# EAGLE design PRC-1605-AFC (EAGLE 9.5.0)
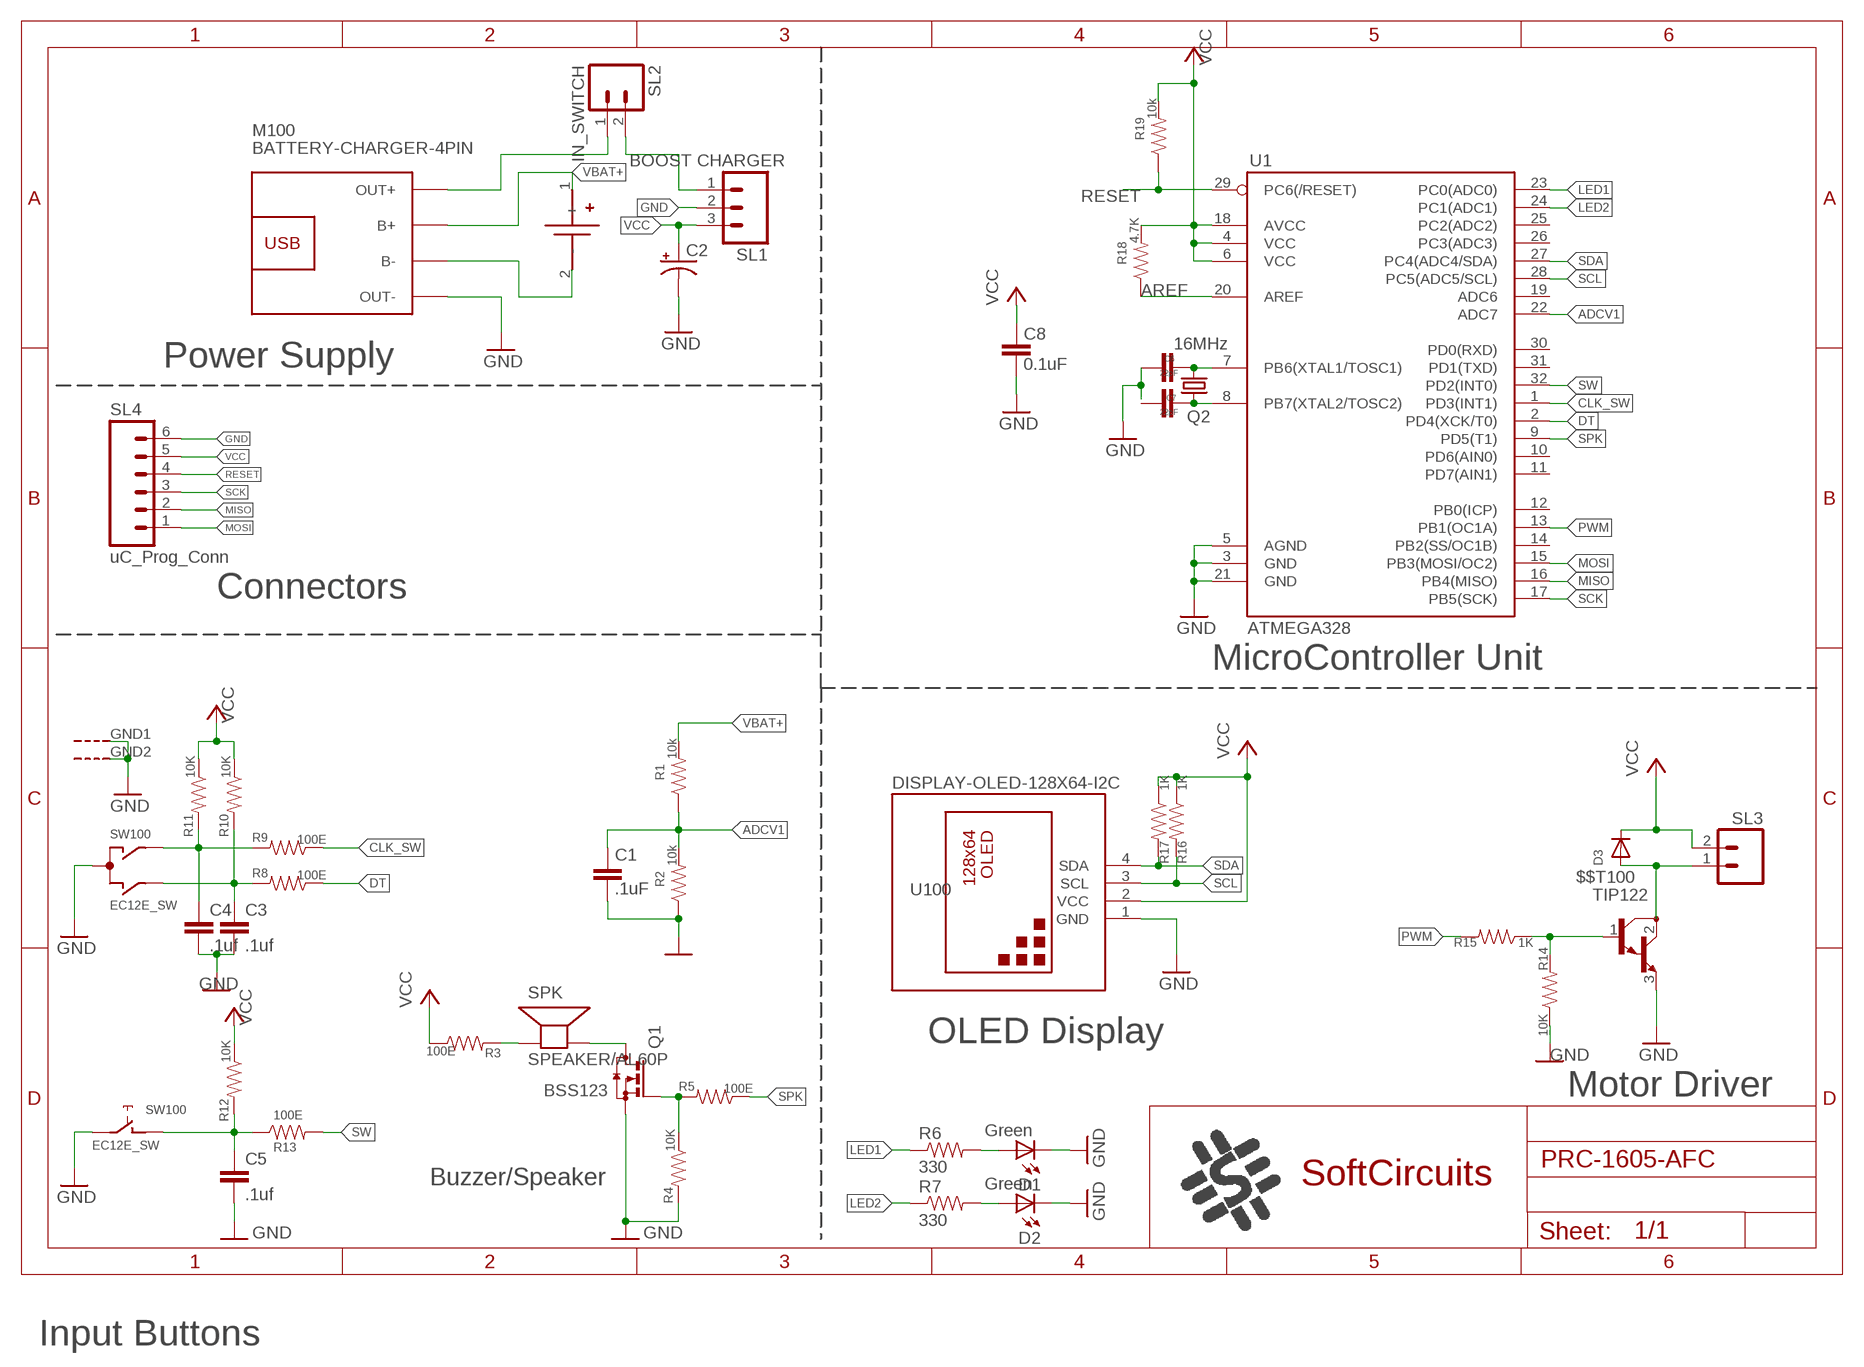
[diagram p0: schematic, sheet 1]

## Parts
$$T100  TIP122  [TO220]
C1  .1uF  C-EUC1206  [C1206]
C2  CPOL-USE2.5-7  [E2,5-7]
C3  .1uf  C-EUC1206  [C1206]
C4  .1uf  C-EUC1206  [C1206]
C5  .1uf  C-EUC1206  [C1206]
C6  22pF  C-EUC1206  [C1206]
C7  22pF  C-EUC1206  [C1206]
C8  0.1uF  C-EUC1206  [C1206]
D1  Green  LEDCHIPLED_1206  [CHIPLED_1206]
D2  Green  LEDCHIPLED_1206  [CHIPLED_1206]
D3  DIODESMA  [SMADIODE]
LOGO100  SC_LOGO  [SC_LOGO]
M100  BATTERY-CHARGER-4PIN  [BATTERY-CHARGER-LI-4PIN]
Q1  BSS123  [SOT23]
Q2  16MHz  CRYSTALHC49UP  [HC49UP]
R1  10k  RESISTOR1206  [1206]
R2  10k  RESISTOR1206  [1206]
R3  100E  RESISTOR1206  [1206]
R4  10K  RESISTOR1206  [1206]
R5  100E  RESISTOR1206  [1206]
R6  330  RESISTOR1206  [1206]
R7  330  RESISTOR1206  [1206]
R8  100E  RESISTOR1206  [1206]
R9  100E  RESISTOR1206  [1206]
R10  10K  RESISTOR1206  [1206]
R11  10K  RESISTOR1206  [1206]
R12  10K  RESISTOR1206  [1206]
R13  100E  RESISTOR1206  [1206]
R14  10K  RESISTOR1206  [1206]
R15  1K  RESISTOR1206  [1206]
R16  1K  RESISTOR1206  [1206]
R17  1K  RESISTOR1206  [1206]
R18  4.7K  RESISTOR1206  [1206]
R19  10k  RESISTOR1206  [1206]
SL1  BOOST CHARGER  M03  [03P]
SL2  IN_SWITCH  M02  [02P]
SL3  M02  [02P]
SL4  uC_Prog_Conn  M06  [06P]
SPK  SPEAKER/AL60P  [AL60P]
SW100  EC12E_SW  [ALPS_EC12E_SW]
U1  ATMEGA328  ATMEGA168  [TQFP32-08]
U100  DISPLAY-OLED-128X64-I2C  [DISPLAY-OLED-128X64-I2C]
U$2  BLOSSOM-BLM-18650-1PCS  [BLOSSOM-BLM-18650-1PCS]

## Nets
ADCV1: C1.1 R1.1 R2.2 U1.22(ADC7)
AREF: R18.1 U1.20(AREF)
CLK_SW: R9.1 U1.1(PD3(INT1))
DT: R8.1 U1.2(PD4(XCK/T0))
GND: $$T100.3(E) C1.2 C2.- C3.2 C4.2 C5.2 C6.2 C7.2 C8.1 D1.C D2.C M100.OUT- Q1.2(S) R2.1 R4.2 R14.1 SL1.2 SL4.6 SW100.C SW100.E SW100.GND1(G) SW100.GND2(G) U1.3(GND) U1.5(AGND) U1.21(GND) U100.1(GND)
LED1: R6.1 U1.23(PC0(ADC0))
LED2: R7.1 U1.24(PC1(ADC1))
MISO: SL4.2 U1.16(PB4(MISO))
MOSI: SL4.1 U1.15(PB3(MOSI/OC2))
N$1: R3.2 SPK.1(+)
N$2: C5.1 R12.2 R13.1 SW100.D
N$3: Q1.3(D) SPK.2(-)
N$5: SL1.1 SL2.2
N$7: C4.1 R9.2 R11.2 SW100.A
N$8: M100.B- U$2.2(-)
N$9: Q1.1(G) R4.1 R5.2
N$10: D2.A R7.2
N$11: C3.1 R8.2 R10.2 SW100.B
N$15: C7.1 Q2.1 U1.8(PB7(XTAL2/TOSC2))
N$16: C6.1 Q2.2 U1.7(PB6(XTAL1/TOSC1))
N$17: D1.A R6.2
N$41: $$T100.1(B) R14.2 R15.1
N$46: $$T100.2(C) D3.A SL3.1
PWM: R15.2 U1.13(PB1(OC1A))
RESET: R19.1 SL4.4 U1.29(PC6(/RESET))
SCK: SL4.3 U1.17(PB5(SCK))
SCL: R16.2 U1.28(PC5(ADC5/SCL)) U100.3(SCL)
SDA: R17.2 U1.27(PC4(ADC4/SDA)) U100.4(SDA)
SPK: R5.1 U1.9(PD5(T1))
SW: R13.2 U1.32(PD2(INT0))
VBAT+: M100.B+ R1.2 U$2.1(+)
VCC: C2.+ C8.2 D3.C R3.1 R10.1 R11.1 R12.1 R16.1 R17.1 R18.2 R19.2 SL1.3 SL3.2 SL4.5 U1.4(VCC) U1.6(VCC) U1.18(AVCC) U100.2(VCC)
VOUT_CHG: M100.OUT+ SL2.1
Unconnected: U1.10(PD6(AIN0)) U1.11(PD7(AIN1)) U1.12(PB0(ICP)) U1.14(PB2(SS/OC1B)) U1.19(ADC6) U1.25(PC2(ADC2)) U1.26(PC3(ADC3)) U1.30(PD0(RXD)) U1.31(PD1(TXD))

## Notes on the sheet
- Power Supply
- Connectors
- MicroController Unit
- OLED Display
- Motor Driver
- Buzzer/Speaker | SoftCircuits
- Input Buttons

## Library data of the parts
$$T100 = transistor:TIP122: NPN BIPOLAR DARLINGTON TRANSISTOR
C1 C3-C8 = SoftCircuits-Capacitors:C-EU: CAPACITOR, European symbol; SPICEPREFIX: C
C2 = SoftCircuits-Capacitors:CPOL-US: POLARIZED CAPACITOR, American symbol; SPICEPREFIX: C
D1 D2 = adafruit:LED: LED OSRAM: - CHIPLED LG R971, LG N971, LY N971, LG Q971, LY Q971, LO R971, LY R971 LH N974, LH R974 LS Q976, LO Q976, LY Q976 LO Q996 - Hyper CHIPLED LW Q18S LB Q993, LB Q99A, LB R99A - SideLED LS A670, LO A670, LY A670, LG A670, LP A670 LB A673, LV A673, LT A673, LW A673 LH A674 LY A675 LS A676, LA A676, LO A676, LY A676, LW A676 LS A679, LY A679, LG A679 - Hyper Micro SIDELED® LS Y876, LA Y876, LO Y876, LY Y876 LT Y87S - SmartLED LW L88C, LW L88S LB L89C, LB L89S, LG L890 LS L89K, LO L89K, LY L89K LS L896, LA L896, LO L896, LY L896 - TOPLED LS T670, LO T670, LY T670, LG T670, LP T670 LSG T670, LSP T670, LSY T670, LOP T670, LYG T670 LG T671, LOG T671, LSG T671 LB T673, LV T673, LT T673, LW T673 LH T674 LS T676, LA T676, LO T676, LY T676, LB T676, LH T676, LSB T676, LW T676 LB T67C, LV T67C, LT T67C, LS T67K, LO T67K, LY T67K, LW E67C LS E67B, LA E67B, LO E67B, LY E67B, LB E67C, LV E67C, LT E67C LW T67C LS T679, LY T679, LG T679 LS T770, LO T770, LY T770, LG T770, LP T770 LB T773, LV T773, LT T773, LW T773 LH T774 LS E675, LA E675, LY E675, LS T675 LS T776, LA T776, LO T776, LY T776, LB T776 LHGB T686 LT T68C, LB T68C - Hyper Mini TOPLED® LB M676 - Mini TOPLED Santana® LG M470 LS M47K, LO M47K, LY M47K Source: http://www.osram.convergy.de/
D3 = adafruit:DIODE: Diode SMADIODE - SMA Surface Mount Package 20V 1A Schottky Diode Digikey: 641-1014-6-ND DO-1N4148 - Through Hole Small Current Diode SOD-123 20V 1 A (.5mV Vf) Schottky Diode - Digikey: MBRX120TPMSCT-ND SOD-323 10V 570mA (.38mV Vf, 3ns) Schottky Diode - Digikey: ZLLS410CT-ND SOD-523 30V 30mA Schottky Diode (RB751S-40TE61) - Digikey: RB751S-40TE61CT-ND SOT23-R/W - SOT23 Package (R = Solder Paste/Reflow Ovens, W = Hand-Soldering) BAT54Film 40V 300mA - Digikey: 497-7162-1-ND
LOGO100 = _SoftCircuits_logo:SC_LOGO; SIZE: 150DPI
M100 = Battery_Charger_Li:BATTERY-CHARGER-4PIN: Li-ion battery charger module with micro USB input. [library edited to remove 2 input pins]
Q1 = transistor-small-signal:BSS123: N-CHANNEL MOS FET
Q2 = adafruit:CRYSTAL: CRYSTAL; OC_FARNELL: unknown; OC_NEWARK: unknown
R1-R19 = SoftCircuits-Resistors:RESISTOR: Resistor Basic schematic elements and footprints for 0603, 1206, and PTH resistors.
SL1 = con-amp-quick:M03: AMP QUICK CONNECTOR; OC_FARNELL: unknown; OC_NEWARK: unknown
SL2 SL3 = con-amp-quick:M02: AMP QUICK CONNECTOR; OC_FARNELL: unknown; OC_NEWARK: unknown
SL4 = con-amp-quick:M06: AMP QUICK CONNECTOR; OC_FARNELL: unknown; OC_NEWARK: unknown
SPK = adafruit:SPEAKER: SPEAKER Source: Buerklin Added PS12 (for part # PS1240 piezo) http://www.ladyada.net/library/pcb/eaglelibrary.html
SW100 = switch-alps:EC12E_SW: ALPS rotary Encoder EC12E series with switch; MPN: EC12E2424407; OC_FARNELL: 1520813; OC_NEWARK: 74M1068
U1 = SparkFun:ATMEGA168
U100 = diy-modules1.8:DISPLAY-OLED-128X64-I2C: 128x64 Dot Matrix OLED Module based on SSD1306 chip Variant with I2C interface More details available here: http://www.instructables.com/id/Monochrome-096-i2c-OLED-display-with-arduino-SSD13/ SSD1306 datasheet: https://cdn-shop.adafruit.com/datasheets/SSD1306.pdf Click here to find device on ebay.com <http://www.ebay.com/sch/oled+display+128x64+iic> Note: There are two variants: I2C and SPI. Search for the proper version.
U$2 = battery-holders:BLOSSOM-BLM-18650-1PCS

## Board
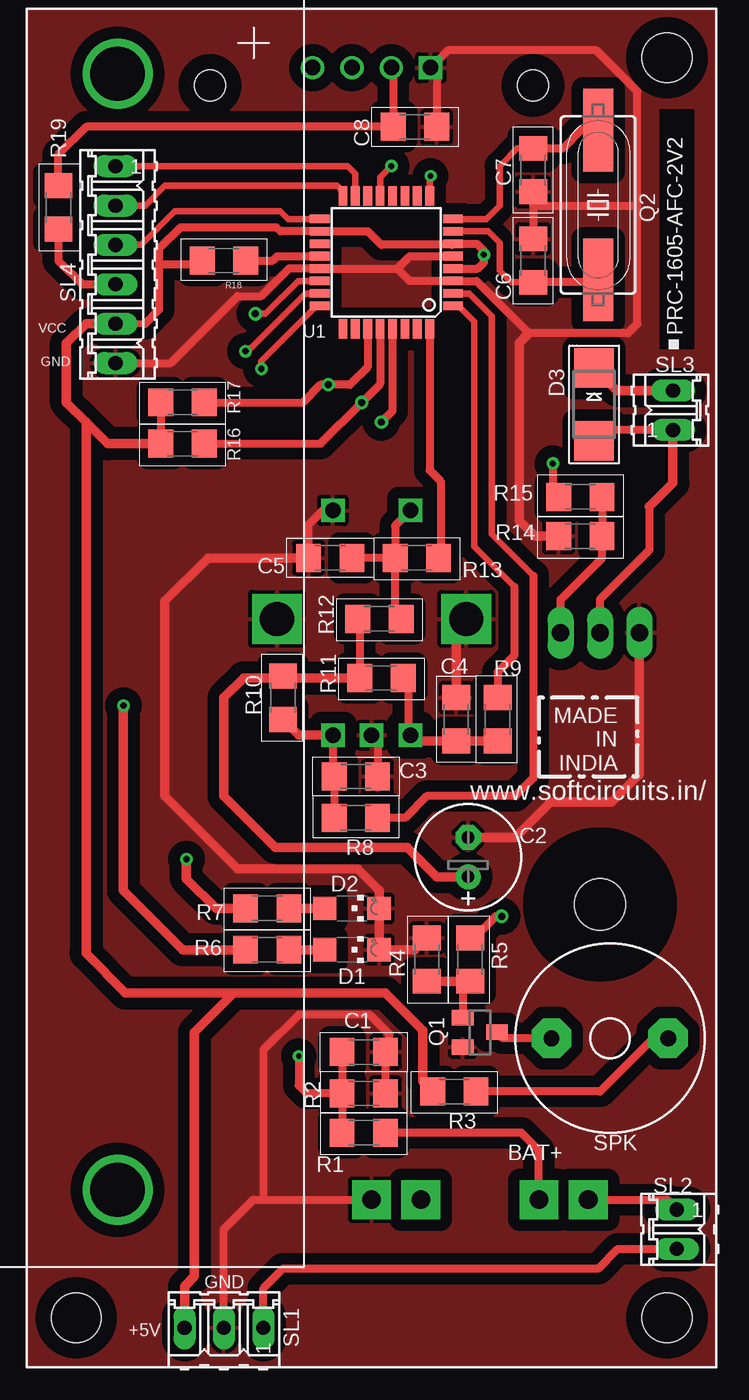
[diagram p1: board, top side]
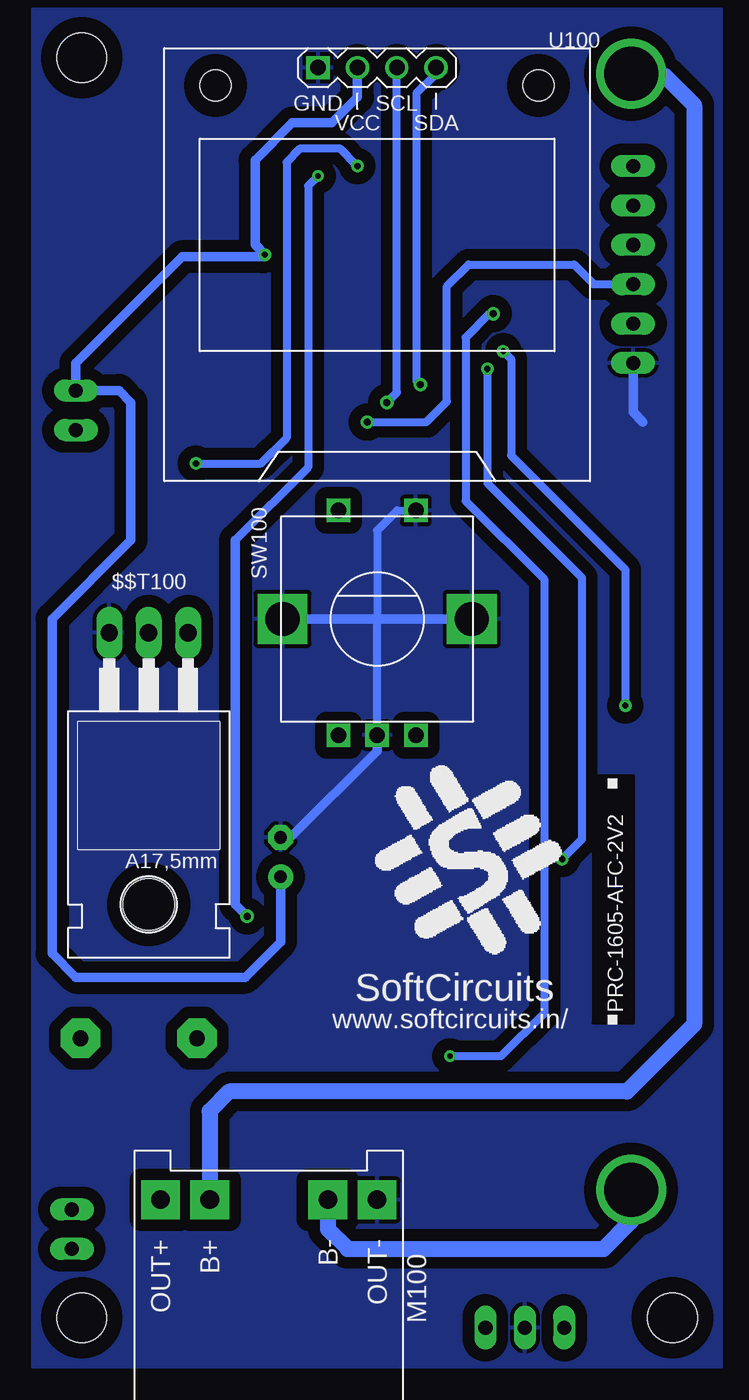
[diagram p2: board, bottom side, seen from below]

No outline drawn. Coordinates in mm, seen from the top.
Copper layers (1*16): Top 0.035mm / dielectric 1.5mm / Bottom 0.035mm
Design rules "default": minimum track width 6mil, minimum drill 0.35mm, track to track 6mil, track to pad 6mil, pad to pad 6mil, via to via 6mil, smd to smd 6mil, copper to edge 40mil, drill to drill 6mil, minimum pad ring 10mil, minimum via ring 8mil, stop-mask expansion 4mil, vias tented up to drill 0mil, thermal gap 10mil
Holes 3.2 mm at 3.17,3.17 41.27,3.17 41.27,84.45

### Footprints (pad centres in the part's own frame; a part is rotated, then mirrored left to right if it is on the bottom)
TO220 = drill 1.118 long: 1 -2.54,-6.35; 2 0,-6.35; 3 2.54,-6.35 | hole 3.302: 0,11.176
C1206 = smd 1.6 x 1.8: 1 -1.4,0; 2 1.4,0
E2,5-7 = drill 0.813 pad 1.6: + -1.27,0 | drill 0.813 pad 1.6 octagon: - 1.27,0
CHIPLED_1206 = smd 1.5 x 1.5: A 0,-1.75; C 0,1.75
SMADIODE = smd 2.54 x 2.54: A 2.349,0; C -2.349,0
BATTERY-CHARGER-LI-4PIN = drill 1.2 pad 2.5 square: B+ 10.795,3.81; B- 10.795,-3.81; OUT+ 10.795,6.985; OUT- 10.795,-6.985
SOT23 = smd 1 x 1.4: 1 -0.95,-1.1; 2 0.95,-1.1; 3 0,1.1
HC49UP = smd 5.334 x 1.93: 1 -4.826,0; 2 4.826,0
1206 = smd 1.6 x 1.8: 1 -1.4,0; 2 1.4,0
03P = drill 0.914 long: 1 -2.54,0; 2 0,0; 3 2.54,0
02P = drill 0.914 long: 1 -1.27,0; 2 1.27,0
06P = drill 0.914 long: 1 -6.35,0; 2 -3.81,0; 3 -1.27,0; 4 1.27,0; 5 3.81,0; 6 6.35,0
AL60P = drill 1.016 pad 2.54 octagon: 1 -3.759,0; 2 3.759,0
ALPS_EC12E_SW = drill 1 square: A -2.5,-7.5; B 2.5,-7.5; C 0,-7.5; D -2.5,7; E 2.5,7 | drill 2.2 square: GND1 -6.1,0; GND2 6.1,0
TQFP32-08 = smd 1.27 x 0.559: 1 -4.293,2.8; 2 -4.293,2; 3 -4.293,1.2; 4 -4.293,0.4; 5 -4.293,-0.4; 6 -4.293,-1.2; 7 -4.293,-2; 8 -4.293,-2.8; 17 4.293,-2.8; 18 4.293,-2; 19 4.293,-1.2; 20 4.293,-0.4; 21 4.293,0.4; 22 4.293,1.2; 23 4.293,2; 24 4.293,2.8 | smd 0.559 x 1.27: 9 -2.8,-4.293; 10 -2,-4.293; 11 -1.2,-4.293; 12 -0.4,-4.293; 13 0.4,-4.293; 14 1.2,-4.293; 15 2,-4.293; 16 2.8,-4.293; 25 2.8,4.293; 26 2,4.293; 27 1.2,4.293; 28 0.4,4.293; 29 -0.4,4.293; 30 -1.2,4.293; 31 -2,4.293; 32 -2.8,4.293
DISPLAY-OLED-128X64-I2C = drill 1 square: 1 -3.81,12.7 | drill 1: 2 -1.27,12.7; 3 1.27,12.7; 4 3.81,12.7 | hole 2: -10.414,11.557; 10.414,11.557
BLOSSOM-BLM-18650-1PCS = drill 3.5: 1 -38.98,0; 2 33.02,0

### Placement (x,y rotation side)
$$T100  36.96,41.02 180 bottom
C1  21.72,20.32 0 top
C2  28.45,32.89 90 top
C3  21.21,38.1 0 top
C4  27.69,41.78 90 top
C5  19.56,52.2 180 top
C6  32.64,71.37 90 top
C7  32.64,77.22 270 top
C8  25.02,80.01 180 top
D1  20.95,26.92 270 top
D2  20.95,29.59 270 top
D3  36.58,62.1 270 top
LOGO100  15.88,33.02 180 bottom
M100  29.21,0 90 bottom
Q1  29.21,21.59 270 top
Q2  36.83,74.97 270 top
R1  21.72,15.11 0 top
R2  21.72,17.65 180 top
R3  27.56,17.78 0 top
R4  25.78,26.29 90 top
R5  28.57,26.29 270 top
R6  15.49,26.92 0 top
R7  15.49,29.59 0 top
R8  21.21,35.43 180 top
R9  30.35,41.78 270 top
R10  16.51,43.18 270 top
R11  22.86,44.45 0 top
R12  22.73,48.26 0 top
R13  25.14,52.2 0 top
R14  35.69,53.59 0 top
R15  35.69,56.13 180 top
R16  10.03,59.56 0 top
R17  10.03,62.23 0 top
R18  12.7,71.37 180 top
R19  2.03,74.8 90 top
SL1  12.7,2.54 180 top
SL2  41.91,8.89 270 top
SL3  41.66,61.72 90 top
SL4  5.71,71.12 270 top
SPK  37.59,21.21 180 top
SW100  22.23,48.26 0 bottom
U1  23.17,71.26 180 top
U100  22.23,71.12 0 bottom
U$2  5.84,44.45 270 top

### Tracks (layer width: path | path; a pad name or v marks a point on that pad's centre or on a via)
ADCV1  (via drill 0.35, 0.45)
  Top 0.406: U1.22 17.48,70.06 15.37,67.94 v14.73,67.94
  Top 0.508: R2.2 R1.1 | C1.1 R2.2 | R2.2 18.03,17.65 17.53,18.16 v17.53,20.07
  Bottom 0.508: v17.53,20.07 14.22,20.07 11.43,22.86 11.43,50.8 16.51,55.88 16.51,66.42 14.99,67.94 v14.73,67.94
AREF
  Top 0.508: U1.20 16.13,71.66 15.85,71.37 R18.1
CLK_SW
  Top 0.406: 31.43,50.35 28.83,52.94 28.83,67.44 27.8,68.46 U1.1
  Top 0.508: 31.43,50.35 31.43,45.91 30.35,44.83 R9.1
DT
  Top 0.406: U1.2 28.53,69.26 29.99,67.8 29.99,53.73 32.66,51.06
  Top 0.508: 32.66,51.06 32.66,38 31.5,36.83 25.78,36.83 24.38,35.43 R8.1
GND
  Top 0.508: C5.2 18.16,54.35 19.07,55.26 SW100.E | C8.1 26.42,83.44 U100.1 27.16,84.95 36.72,84.95 39.37,82.3 39.37,74.93 | 23.87,70.86 U1.21 16.89,70.86 15.11,69.09 13.59,69.09 9.27,64.77 SL4.6 | U1.5 24.67,71.66 23.87,70.86 | 23.87,70.86 24.67,70.06 U1.3 29,70.06 32.37,66.69 38.75,66.69 39.37,67.31 39.37,74.93 | 39.5,44.58 39.5,45.72 $$T100.3 | C7.2 32.64,74.93 | 32.64,74.93 C6.2 | 32.64,74.93 39.37,74.93 | SL1.2 12.7,8.89 14.61,10.79 15.24,10.79 | 15.24,10.79 M100.OUT- | R2.1 C1.2 23.37,20.57 23.37,21.46 22.1,22.73 17.53,22.73 15.24,20.45 15.24,10.79 | SW100.C 22.61,40.38 C3.2 | R4.2 25.02,26.92
  Top 0.61: C5.2 11.68,52.2 8.89,49.4 8.89,36.83 13.59,32.13 21.34,32.13 22.7,30.76 D2.C D1.C 25.02,26.92 | 39.5,45.72 39.5,38.23 37.72,36.45 33.78,36.45 31.5,34.16 C2.- | SW100.GND1 27.69,47.62 C4.2 | 32.37,66.69 31.75,66.06 31.75,54.61 32.77,53.59 R14.1
  Bottom 0.508: SW100.C 22.23,48.26 22.23,53.98 20.94,55.26 SW100.E
  Bottom 0.61: SW100.GND2 22.23,48.26 SW100.GND1 | SW100.C 22.23,39.75 27.81,34.16 C2.- | SL4.6 5.71,61.59 5.08,60.96
  pour Top (isolate 0.762): 0,87.63 44.45,87.63 44.45,0 0,0
  pour Bottom (isolate 0.762): 0,87.63 44.45,87.63 44.45,0 0,0
LED1  (via drill 0.4)
  Top 0.406: U1.23 17.95,69.26 14.22,65.53 v14.1,65.53
  Top 0.61: R6.1 10.03,26.92 6.23,30.73 v6.23,42.67 v6.22,42.67
  Bottom 0.508: v14.1,65.53 13.59,65.02 13.59,58.8 6.22,51.44 v6.22,42.67
LED2  (via drill 0.4)
  Top 0.406: U1.24 18.68,68.46 15.11,64.9 v15.11,64.39
  Top 0.61: R7.1 12.19,29.59 10.29,31.5 v10.29,32.77
  Bottom 0.508: v15.11,64.39 15.11,57.02 9.02,50.93 9.02,34.04 v10.29,32.77
MISO
  Top 0.406: 20.37,75.83 20,76.2 8.89,76.2 7.62,74.93 SL4.2
  Top 0.508: U1.16 20.37,75.83
MOSI
  Top 0.406: U1.15 21.17,77 20.7,77.47 SL4.1
N$1
  Top 0.508: SPK.1 40.39,21.21 36.96,17.78 R3.2
N$2
  Top 0.508: SW100.D 23.74,54.28 R13.1 | R13.1 C5.1 | R12.2 23.74,48.65 R13.1
N$3
  Top 0.508: SPK.2 30.69,21.21 Q1.3
N$4
  cutout Bottom: 8.26,38.1 8.26,22.23 5.71,22.23 5.71,38.1
N$5
  Top 0.508: SL1.1 15.24,5.08 16.51,6.35 36.83,6.35 38.1,7.62 SL2.2
N$6
  cutout Top: 40.89,81.03 40.89,65.79 42.93,65.79 42.93,81.03
N$7
  Top 0.508: SW100.A 24.6,40.89 24.6,44.11 R11.2
  Top 0.61: SW100.A 25.1,40.38 C4.1 R9.2
N$8
  Bottom 1.016: M100.B- 25.4,8.89 24.13,7.62 7.62,7.62 5.88,9.36 U$2.2
N$9
  Top 0.508: R5.2 28.63,24.89 28.11,24.52 Q1.1
  Top 0.61: R4.1 28.63,24.89
N$10
  Top 0.61: D2.A R7.2
N$11
  Top 0.508: SW100.B 19.73,38.18 C3.1 R8.2
  Top 0.61: R10.2 17.53,40.76 SW100.B
N$15
  Top 0.406: U1.8 29.61,74.06 30.48,74.93 30.48,77.47 31.63,78.62 C7.1
  Top 0.508: Q2.1 35.72,79.79 34.54,78.61 33.65,78.61 33.52,78.62 C7.1
N$16
  Top 0.406: U1.7 29.74,73.26 30.48,72.52 30.48,70.74 31.24,69.98 C6.1
  Top 0.508: Q2.2 36.67,69.98 C6.1
N$17
  Top 0.61: D1.A R6.2
N$41
  Top 0.508: $$T100.1 34.42,49.53 37.09,52.2 R14.2 R15.1
N$46
  Top 0.508: 40.13,55.5 40.13,52.7 36.96,49.53 $$T100.2 | SL3.1 37.02,60.45 D3.A
  Top 0.61: SL3.1 41.66,57.02 40.13,55.5
PWM  (via drill 0.4)
  Top 0.406: U1.13 22.77,76.75 v23.5,77.47
  Top 0.508: R15.2 34.03,56.13 33.91,56.26 v33.91,58.29
  Bottom 0.508: v33.91,58.29 29.72,58.29 28.07,59.94 28.07,77.72 27.18,78.61 24.64,78.61 v23.5,77.47
RESET  (via drill 0.45)
  Top 0.508: U1.29 23.57,61.67 v22.86,60.96 | R19.1 2.03,71.37 3.55,69.85 SL4.4
  Bottom 0.508: v22.86,60.96 19.05,60.96 17.73,62.28 17.73,69.72 16.33,71.12 9.53,71.12 8.26,69.85 SL4.4
SCK
  Top 0.406: SL4.3 7.37,72.39 9.54,74.57 16.34,74.57 16.85,74.06 U1.17
SCL  (via drill 0.45)
  Top 0.508: U1.28 22.77,63.41 v21.59,62.23 18.92,59.56 R16.2
  Bottom 0.508: v21.59,62.23 20.95,62.87 U100.3
SDA  (via drill 0.45)
  Top 0.508: U1.27 21.97,64.52 20.83,63.37 v19.43,63.37 18.92,63.37 17.78,62.23 R17.2
  Bottom 0.508: U100.4 18.41,83.44 19.68,82.17 19.68,63.63 v19.43,63.37
SPK  (via drill 0.35, 0.45)
  Top 0.406: U1.9 25.97,76.77
  Top 0.508: 25.97,76.77 v26.04,76.83 | R5.1 28.57,27.43 30.23,29.08 v30.61,29.08
  Bottom 0.508: v26.04,76.83 26.67,76.2 26.67,58.04 31.37,53.34
  Bottom 0.61: 31.37,53.34 31.37,29.84 v30.61,29.08
SW
  Top 0.508: R13.2 26.67,52.32 26.67,57.15 25.97,57.85 U1.32
VBAT+
  Top 0.508: M100.B+ 33.02,13.97 31.88,15.11 R1.2
  Bottom 1.016: U$2.1 3.67,83.3 1.78,81.41 1.78,22.1 6.1,17.78 31.75,17.78 33.02,16.51 M100.B+
VCC  (via drill 0.4)
  Top 0.406: 7.62,67.31 SL4.5
  Top 0.508: R12.1 21.46,48.13 R11.1 | 16.64,44.45 R10.1 16.38,44.45 | U100.2 23.62,83.7 C8.2 3.81,80.01 2.03,78.23 R19.2 | U1.4 29.08,70.86 29.46,71.25 v29.46,71.75 29.46,72.01 29.01,72.46 U1.6 27.39,72.39 22.86,72.39 21.99,73.26 U1.18 16.34,73.26 16.09,73.52 9.89,73.52 8.51,72.14 8.51,71.12 | R17.1 R16.1 | 8.51,71.12 8.51,68.2 7.62,67.31 | R18.2 11.05,71.12 8.51,71.12
  Top 0.61: 16.64,44.45 R11.1 | 16.38,44.45 13.97,44.45 12.7,43.18 12.7,36.83 16,33.53 24.51,33.53 26.42,31.62 C2.+ | R3.1 25.52,18.41 25.52,21.72 23.11,24.13 13.34,24.13 | SL1.3 10.16,5.21 10.79,5.84 10.79,21.59 13.34,24.13 | R16.1 5.21,59.56 3.81,60.96 | 3.81,60.96 2.54,62.23 2.54,66.04 3.81,67.31 SL4.5 | 3.81,60.96 3.81,26.67 6.35,24.13 13.34,24.13 | D3.C 38.04,62.99 SL3.2
  Bottom 0.508: 29.59,71.63 v29.46,71.75
  Bottom 0.61: 29.59,71.63 34.8,71.63 41.66,64.77 SL3.2 38.86,62.99 38.1,62.23 38.1,53.34 43.18,48.26 43.18,26.67 41.66,25.15 30.73,25.15 28.45,27.43 C2.+ | v29.46,71.75 30.1,72.39 30.1,77.85 27.69,80.26 25.15,80.26 23.5,81.92 U100.2
VOUT_CHG
  Top 0.508: M100.OUT+ 41.27,10.79 SL2.1

### Text on the board
tPlace: VCC | PRC-1605-AFC-2V2 | GND | MADE / IN / INDIA | www.softcircuits.in/ | BAT+ | GND | +5V
bPlace: SoftCircuits | PRC-1605-AFC-2V2 | www.softcircuits.in/